# Altium schematic sheet HeatingSystem.SchDoc
size A
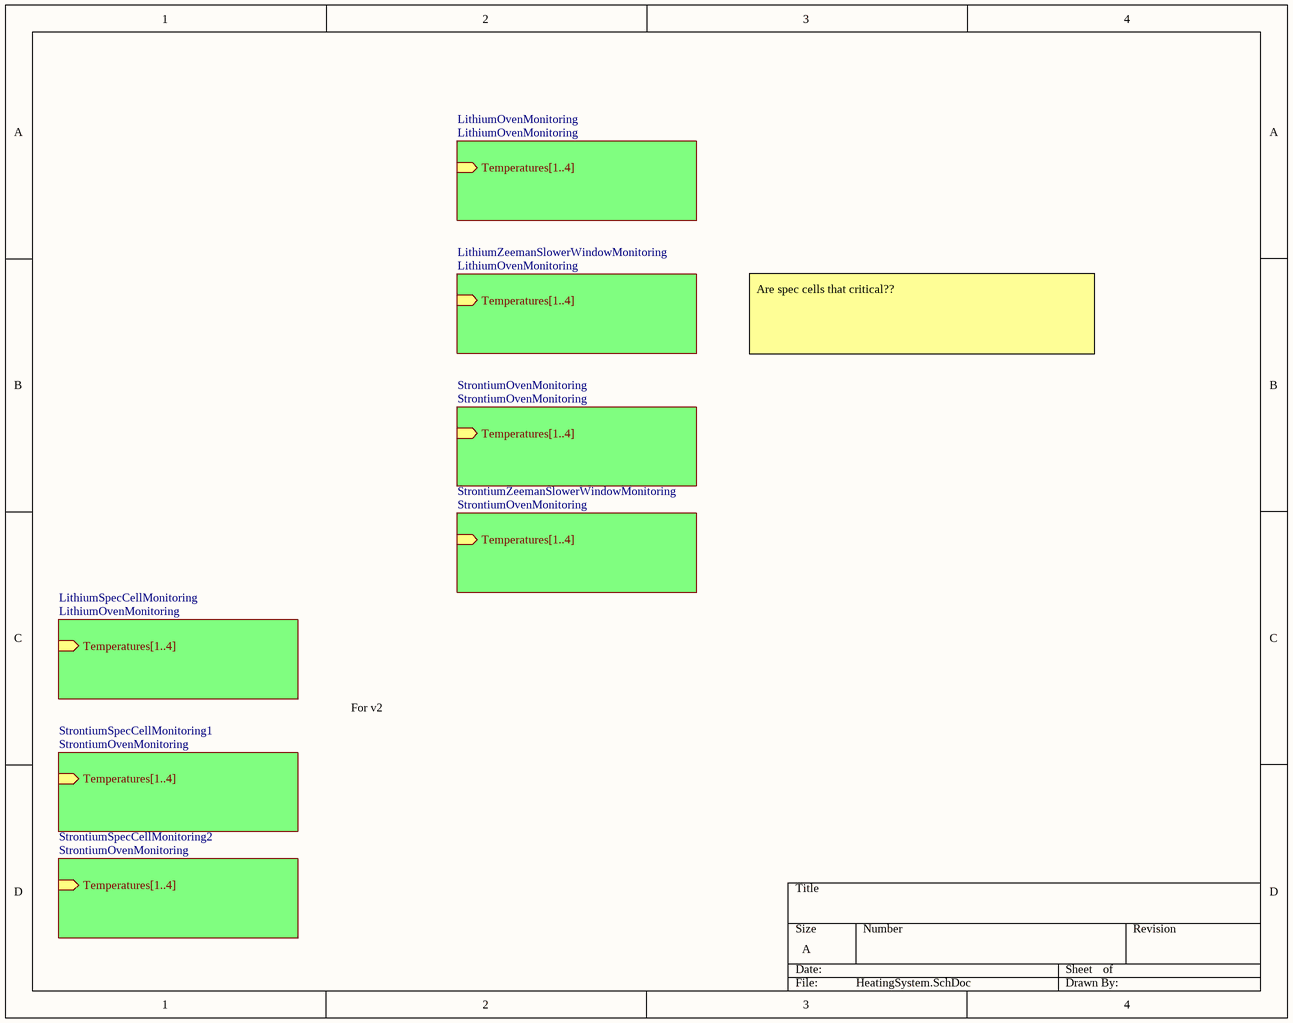
[diagram p0: HeatingSystem.SchDoc]

## Sub-sheets
LithiumOvenMonitoring = LithiumOvenMonitoring: Temperatures[1..4] (in)
LithiumSpecCellMonitoring = LithiumOvenMonitoring: Temperatures[1..4] (in)
LithiumZeemanSlowerWindowMonitoring = LithiumOvenMonitoring: Temperatures[1..4] (in)
StrontiumOvenMonitoring = StrontiumOvenMonitoring: Temperatures[1..4] (in)
StrontiumSpecCellMonitoring1 = StrontiumOvenMonitoring: Temperatures[1..4] (in)
StrontiumSpecCellMonitoring2 = StrontiumOvenMonitoring: Temperatures[1..4] (in)
StrontiumZeemanSlowerWindowMonitoring = StrontiumOvenMonitoring: Temperatures[1..4] (in)

## Notes on the sheet
- Are spec cells that critical??
- For v2